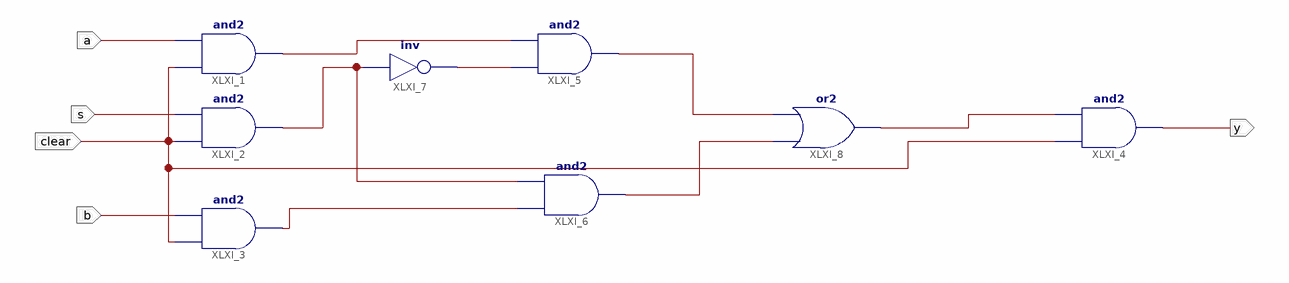
[diagram p0: schematic sheet 1]
// Xilinx ISE schematic MUX.sch (artix7) as structural Verilog: 8 symbols, 5 ports
module MUX (
  input  clear,
  input  a,
  input  s,
  input  b,
  output y
);

  wire XLXN_1, XLXN_2, XLXN_4, XLXN_5, XLXN_12, XLXN_13, XLXN_14;

  and XLXI_1 (XLXN_2, clear, a);
  and XLXI_2 (XLXN_5, clear, s);
  and XLXI_3 (XLXN_4, clear, b);
  and XLXI_4 (y, clear, XLXN_14);
  and XLXI_5 (XLXN_12, XLXN_1, XLXN_2);
  and XLXI_6 (XLXN_13, XLXN_4, XLXN_5);
  not XLXI_7 (XLXN_1, XLXN_5);
  or XLXI_8 (XLXN_14, XLXN_13, XLXN_12);
endmodule
